# EAGLE design ArachnoProto (EAGLE 6.5.0)
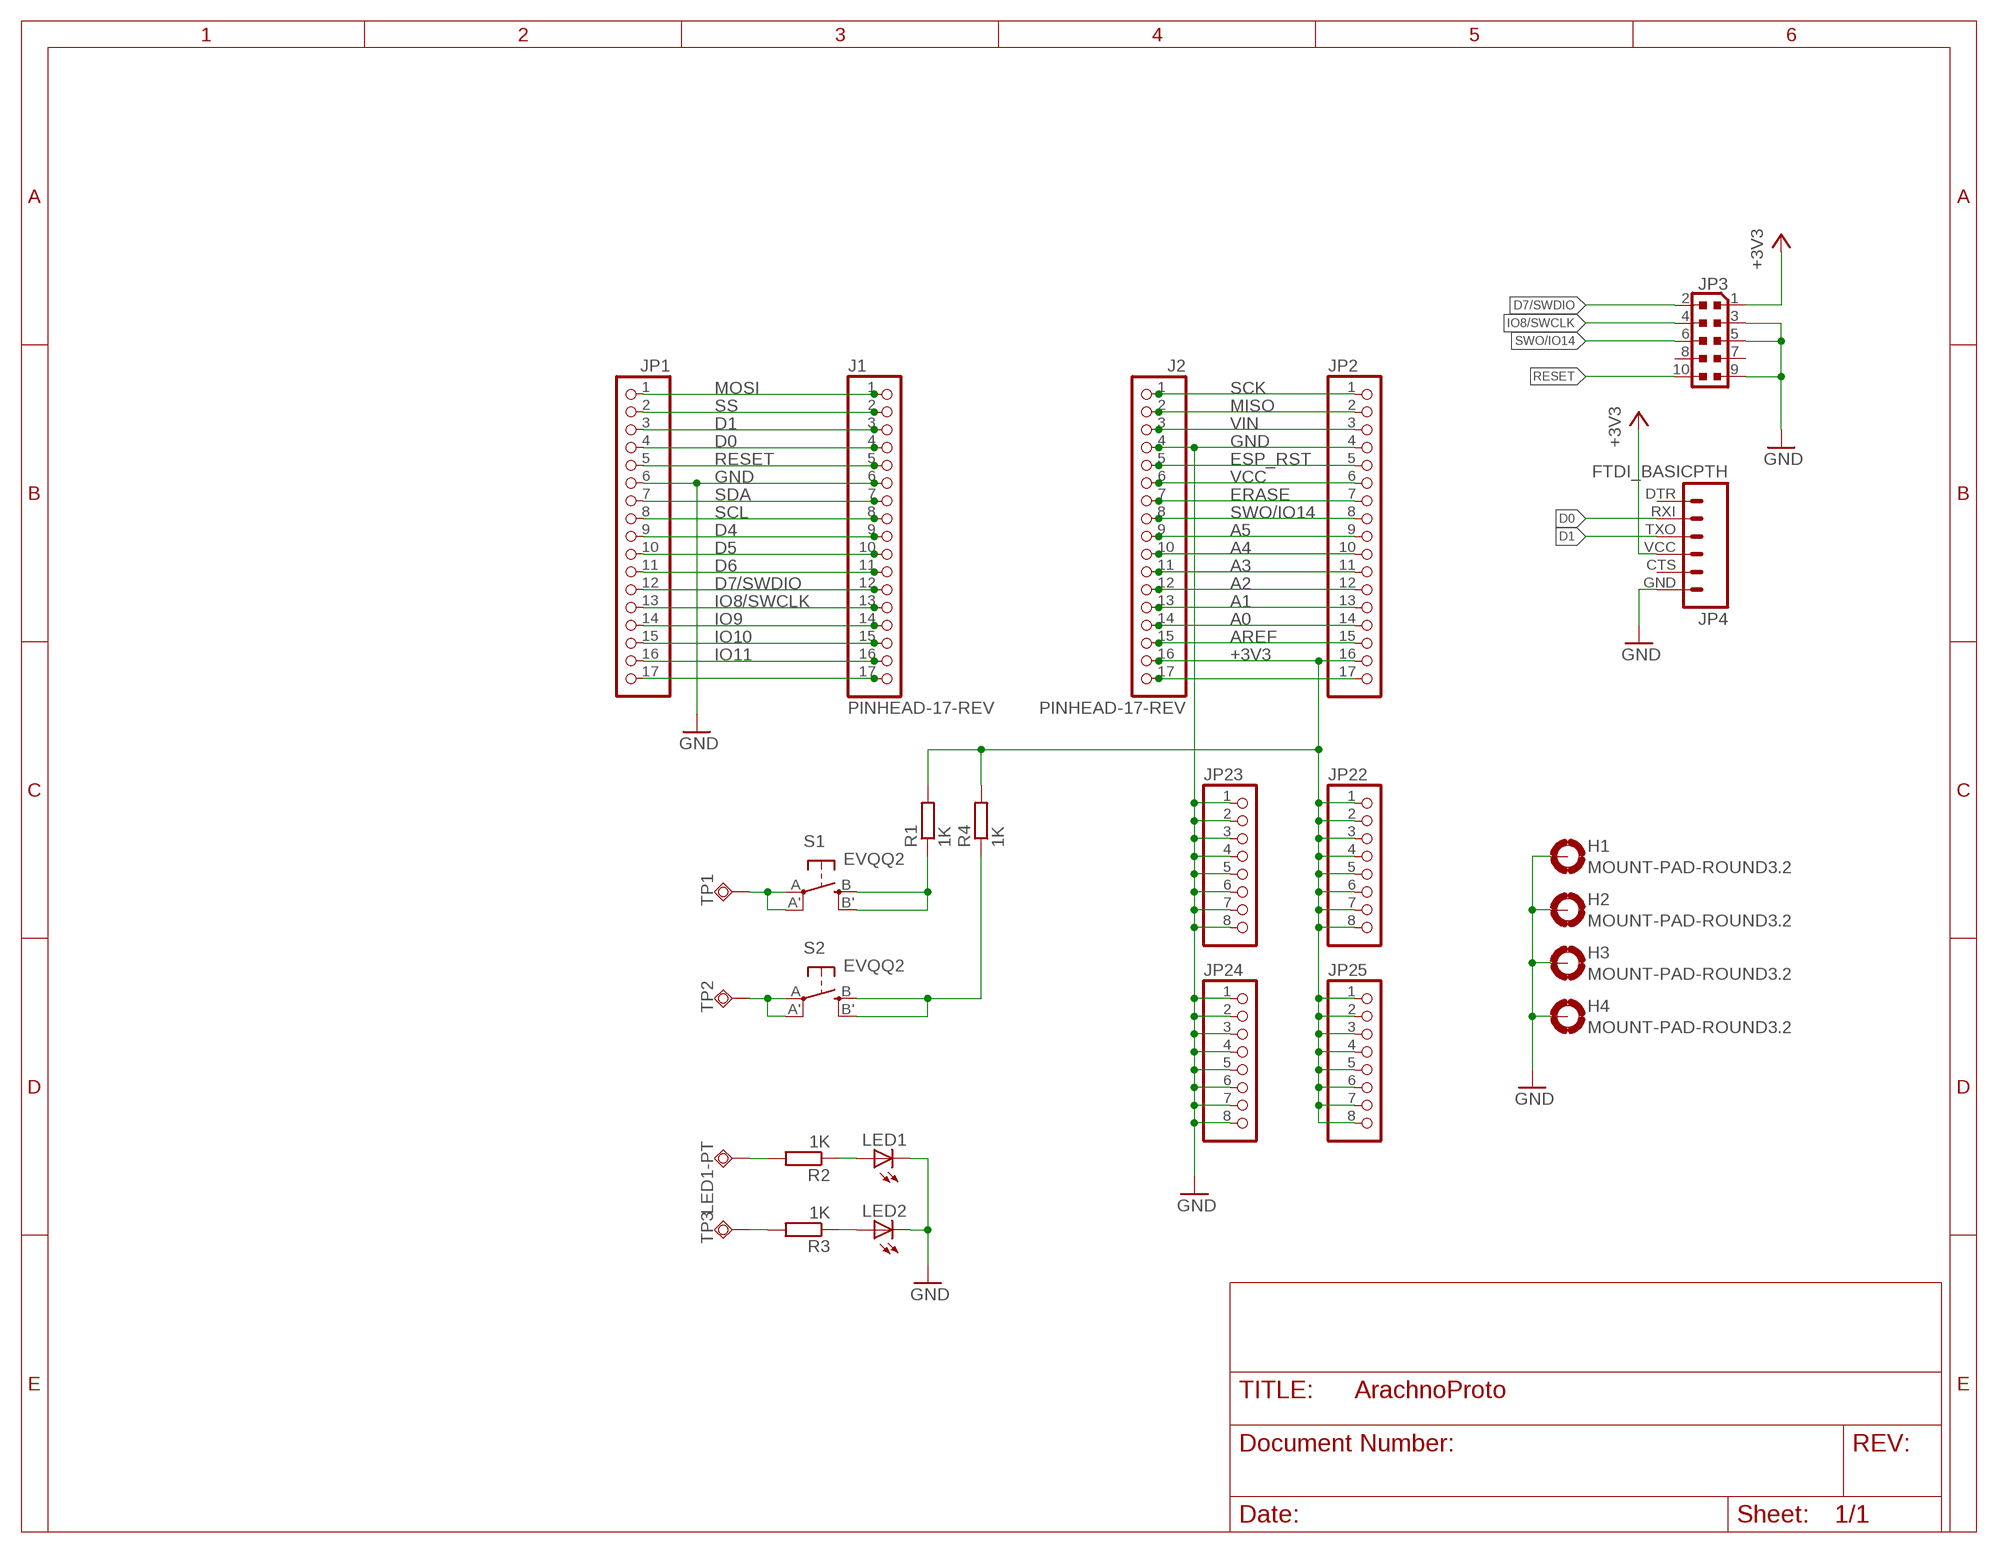
[diagram p0: schematic, sheet 1]

## Parts
H1  MOUNT-PAD-ROUND3.2  [3,2-PAD]
H2  MOUNT-PAD-ROUND3.2  [3,2-PAD]
H3  MOUNT-PAD-ROUND3.2  [3,2-PAD]
H4  MOUNT-PAD-ROUND3.2  [3,2-PAD]
J1  PINHEAD-17-REV  [4UCONN-12573]
J2  PINHEAD-17-REV  [4UCONN-12573]
JP1  PINHD-1X17  [1X17]
JP2  PINHD-1X17  [1X17]
JP3  PINHEAD_PINHD-2X5PASSO127  [PINHEAD_2X05_127]
JP4  FTDI_BASICPTH  [FTDI_BASIC]
JP22  PINHD-1X8  [1X08]
JP23  PINHD-1X8  [1X08]
JP24  PINHD-1X8  [1X08]
JP25  PINHD-1X8  [1X08]
LED1  LEDCHIPLED_1206  [CHIPLED_1206]
LED1-PT  TPSQPAD1-20Y  [P1-20Y]
LED2  LEDCHIPLED_1206  [CHIPLED_1206]
R1  1K  R-EU_R1206  [R1206]
R2  1K  R-EU_R1206  [R1206]
R3  1K  R-EU_R1206  [R1206]
R4  1K  R-EU_R1206  [R1206]
S1  EVQQ2  [EVQ-Q2]
S2  EVQQ2  [EVQ-Q2]
TP1  TPSQPAD1-20Y  [P1-20Y]
TP2  TPSQPAD1-20Y  [P1-20Y]
TP3  TPSQPAD1-20Y  [P1-20Y]

## Nets
+3V3: J2.16 J2.33 J2.50 JP2.16 JP3.1 JP4.VCC JP22.1 JP22.2 JP22.3 JP22.4 JP22.5 JP22.6 JP22.7 JP22.8 JP25.1 JP25.2 JP25.3 JP25.4 JP25.5 JP25.6 JP25.7 JP25.8 R1.2 R4.2
A0: J2.14 J2.31 J2.48 JP2.14
A1: J2.13 J2.30 J2.47 JP2.13
A2: J2.12 J2.29 J2.46 JP2.12
A3: J2.11 J2.28 J2.45 JP2.11
A4: J2.10 J2.27 J2.44 JP2.10
A5: J2.9 J2.26 J2.43 JP2.9
AREF: J2.15 J2.32 J2.49 JP2.15
D0: J1.4 J1.21 J1.38 JP1.4 JP4.RXI
D1: J1.3 J1.20 J1.37 JP1.3 JP4.TXO
D4: J1.9 J1.26 J1.43 JP1.9
D5: J1.10 J1.27 J1.44 JP1.10
D6: J1.11 J1.28 J1.45 JP1.11
D7/SWDIO: J1.12 J1.29 J1.46 JP1.12 JP3.2
ERASE: J2.7 J2.24 J2.41 JP2.7
ESP_RST: J2.5 J2.22 J2.39 JP2.5
GND: H1.B3,2(MOUNT) H2.B3,2(MOUNT) H3.B3,2(MOUNT) H4.B3,2(MOUNT) J1.6 J1.23 J1.40 J2.4 J2.21 J2.38 JP1.6 JP2.4 JP3.3 JP3.5 JP3.9 JP4.GND JP23.1 JP23.2 JP23.3 JP23.4 JP23.5 JP23.6 JP23.7 JP23.8 JP24.1 JP24.2 JP24.3 JP24.4 JP24.5 JP24.6 JP24.7 JP24.8 LED1.C LED2.C
IO8/SWCLK: J1.13 J1.30 J1.47 JP1.13 JP3.4
IO9: J1.14 J1.31 J1.48 JP1.14
IO10: J1.15 J1.32 J1.49 JP1.15
IO11: J1.16 J1.33 J1.50 JP1.16
IO12: J1.17 J1.34 J1.51 JP1.17
IO13: J2.17 J2.34 J2.51 JP2.17
MISO: J2.2 J2.19 J2.36 JP2.2
MOSI: J1.1 J1.18 J1.35 JP1.1
N$1: LED1.A R2.1
N$3: LED2.A R3.1
N$5: LED1-PT.TP R2.2
N$6: R3.2 TP3.TP
N$7: S1.A'(P1) S1.A(P) TP1.TP
N$8: R1.1 S1.B'(S1) S1.B(S)
N$69: R4.1 S2.B'(S1) S2.B(S)
N$70: S2.A'(P1) S2.A(P) TP2.TP
RESET: J1.5 J1.22 J1.39 JP1.5 JP3.10
SCK: J2.1 J2.18 J2.35 JP2.1
SCL: J1.8 J1.25 J1.42 JP1.8
SDA: J1.7 J1.24 J1.41 JP1.7
SS: J1.2 J1.19 J1.36 JP1.2
SWO/IO14: J2.8 J2.25 J2.42 JP2.8 JP3.6
VCC: J2.6 J2.23 J2.40 JP2.6
VIN: J2.3 J2.20 J2.37 JP2.3
Unconnected: JP3.7 JP3.8 JP4.CTS JP4.DTR

## Library data of the parts
H1-H4 = holes:MOUNT-PAD-ROUND: MOUNTING PAD, round
J1 J2 = logos-headers:PINHEAD-17-REV
JP1 JP2 = pinhead:PINHD-1X17: PIN HEADER
JP3 = atmel-d21:PINHEAD_PINHD-2X5: PIN HEADER
JP4 = SparkFun-Connectors:FTDI_BASIC: FTDI Basic header with labels
JP22-JP25 = pinhead:PINHD-1X8: PIN HEADER
LED1 LED2 = led:LED: LED OSRAM: - CHIPLED LG R971, LG N971, LY N971, LG Q971, LY Q971, LO R971, LY R971 LH N974, LH R974 LS Q976, LO Q976, LY Q976 LO Q996 - Hyper CHIPLED LW Q18S LB Q993, LB Q99A, LB R99A - SideLED LS A670, LO A670, LY A670, LG A670, LP A670 LB A673, LV A673, LT A673, LW A673 LH A674 LY A675 LS A676, LA A676, LO A676, LY A676, LW A676 LS A679, LY A679, LG A679 - Hyper Micro SIDELED® LS Y876, LA Y876, LO Y876, LY Y876 LT Y87S - SmartLED LW L88C, LW L88S LB L89C, LB L89S, LG L890 LS L89K, LO L89K, LY L89K LS L896, LA L896, LO L896, LY L896 - TOPLED LS T670, LO T670, LY T670, LG T670, LP T670 LSG T670, LSP T670, LSY T670, LOP T670, LYG T670 LG T671, LOG T671, LSG T671 LB T673, LV T673, LT T673, LW T673 LH T674 LS T676, LA T676, LO T676, LY T676, LB T676, LH T676, LSB T676, LW T676 LB T67C, LV T67C, LT T67C, LS T67K, LO T67K, LY T67K, LW E67C LS E67B, LA E67B, LO E67B, LY E67B, LB E67C, LV E67C, LT E67C LW T67C LS T679, LY T679, LG T679 LS T770, LO T770, LY T770, LG T770, LP T770 LB T773, LV T773, LT T773, LW T773 LH T774 LS E675, LA E675, LY E675, LS T675 LS T776, LA T776, LO T776, LY T776, LB T776 LHGB T686 LT T68C, LB T68C - Hyper Mini TOPLED® LB M676 - Mini TOPLED Santana® LG M470 LS M47K, LO M47K, LY M47K Source: http://www.osram.convergy.de LUXEON: - LUMILED® LXK2-PW12-R00, LXK2-PW12-S00, LXK2-PW14-U00, LXK2-PW14-V00 LXK2-PM12-R00, LXK2-PM12-S00, LXK2-PM14-U00 LXK2-PE12-Q00, LXK2-PE12-R00, LXK2-PE12-S00, LXK2-PE14-T00, LXK2-PE14-U00 LXK2-PB12-K00, LXK2-PB12-L00, LXK2-PB12-M00, LXK2-PB14-N00, LXK2-PB14-P00, LXK2-PB14-Q00 LXK2-PR12-L00, LXK2-PR12-M00, LXK2-PR14-Q00, LXK2-PR14-R00 LXK2-PD12-Q00, LXK2-PD12-R00, LXK2-PD12-S00 LXK2-PH12-R00, LXK2-PH12-S00 LXK2-PL12-P00, LXK2-PL12-Q00, LXK2-PL12-R00 Source: www.luxeon.com KINGBRIGHT: KA-3528ASYC Source: www.kingbright.com
LED1-PT TP1-TP3 = test-fixtures:TPSQ: Test pad
R1-R4 = resistor:R-EU_: RESISTOR, European symbol
S1 S2 = adafruit:EVQQ2: SMT 6mm switch, EVQQ2 series http://www.ladyada.net/library/eagle

## Board
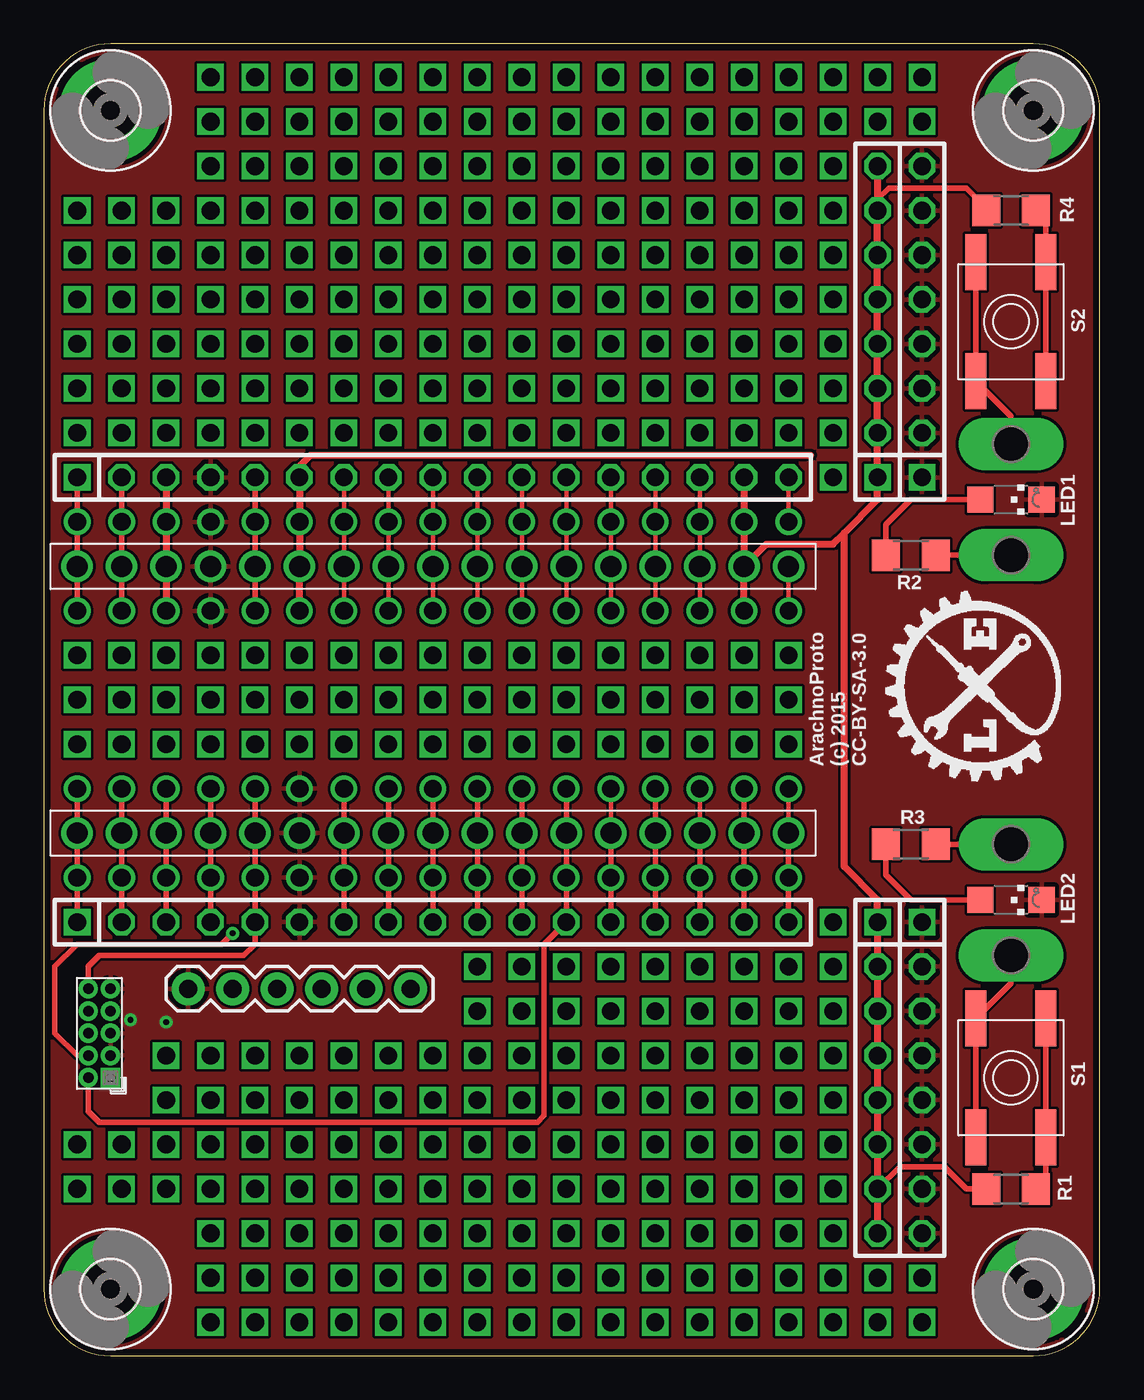
[diagram p1: board, top side]
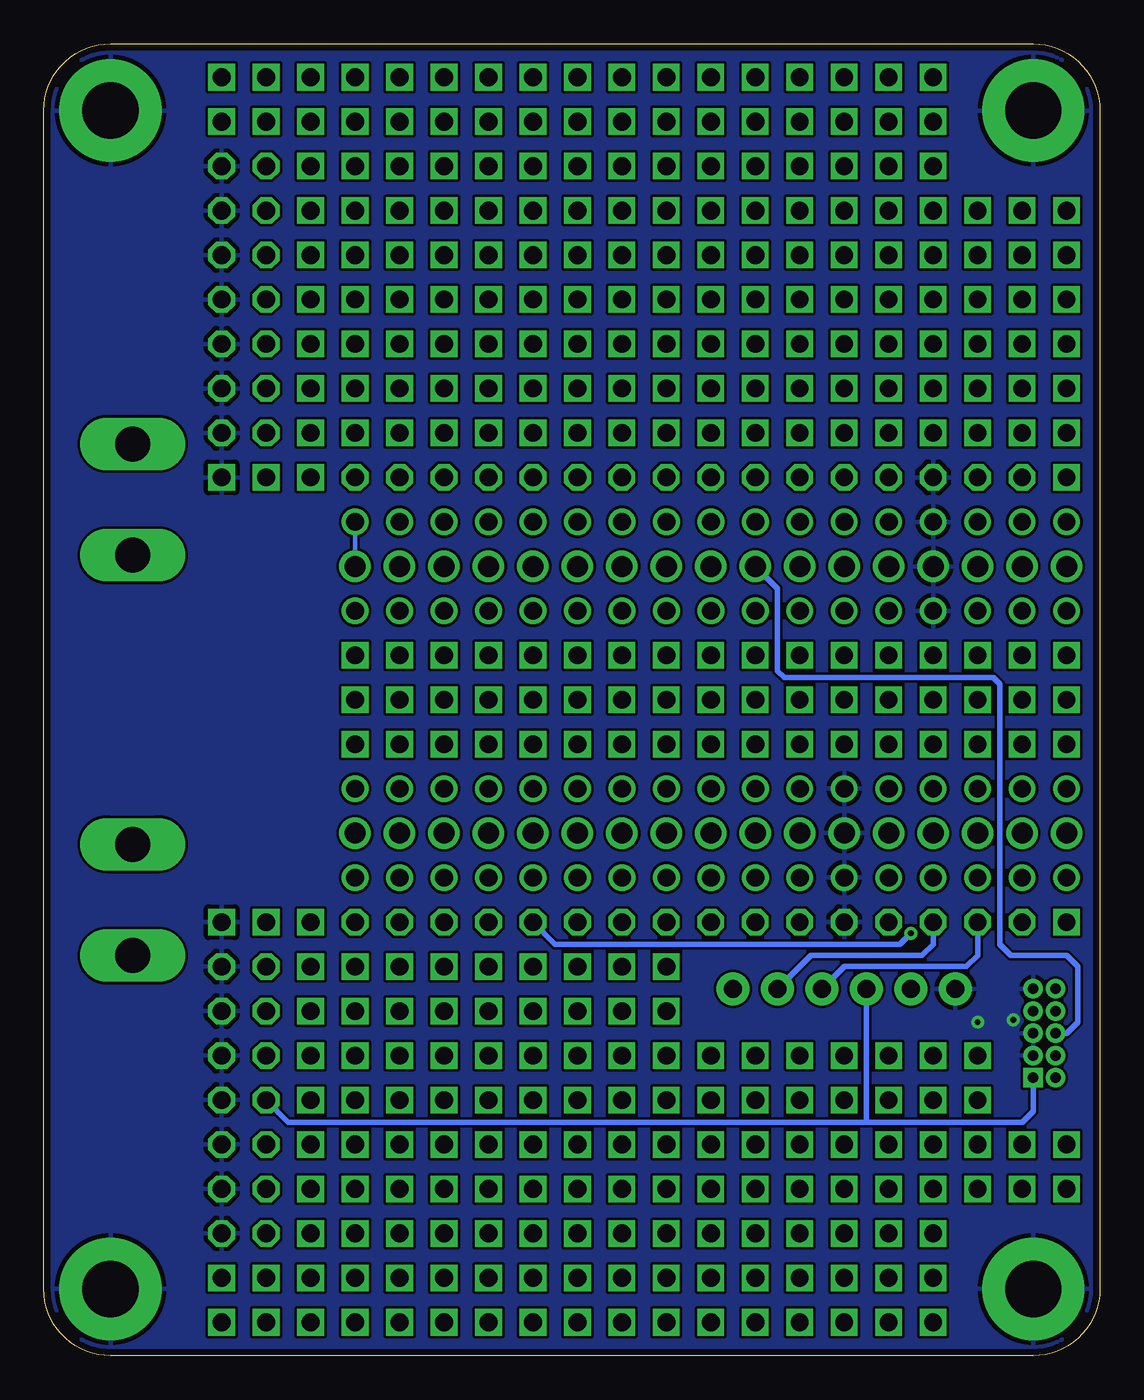
[diagram p2: board, bottom side, seen from below]

Size 60.33 x 74.93 mm. Coordinates in mm from the lower left corner, seen from the top.
Outline: 0,71.12 0,3.81 arc90 3.81,0 56.52,0 arc90 60.33,3.81 60.33,71.12 arc90 56.52,74.93 3.81,74.93 arc90 0,71.12
Copper layers (1*16): Top 0.035mm / dielectric 1.5mm / Bottom 0.035mm
Design rules "default *": minimum track width 6mil, minimum drill 13mil, track to track 6mil, track to pad 6mil, pad to pad 6mil, via to via 6mil, smd to smd 6mil, copper to edge 15mil, drill to drill 15mil, minimum pad ring 10mil, minimum via ring 8mil, stop-mask expansion 4mil, vias tented up to drill 0mil, thermal gap 10mil

### Footprints (pad centres in the part's own frame; a part is rotated, then mirrored left to right if it is on the bottom)
3,2-PAD = drill 3.2 pad 5.842: B3,2 0,0
4UCONN-12573 = drill 1.2: 1 -20.32,0; 2 -17.78,0; 3 -15.24,0; 4 -12.7,0; 5 -10.16,0; 6 -7.62,0; 7 -5.08,0; 8 -2.54,0; 9 0,0; 10 2.54,0; 11 5.08,0; 12 7.62,0; 13 10.16,0; 14 12.7,0; 15 15.24,0; 16 17.78,0; 17 20.32,0 | drill 1.02: 18 -20.32,-2.54; 19 -17.78,2.54; 20 -15.24,-2.54; 21 -12.7,2.54; 22 -10.16,-2.54; 23 -7.62,2.54; 24 -5.08,-2.54; 25 -2.54,2.54; 26 0,-2.54; 27 2.54,2.54; 28 5.08,-2.54; 29 7.62,2.54; 30 10.16,-2.54; 31 12.7,2.54; 32 15.24,-2.54; 33 17.78,2.54; 34 20.32,-2.54; 35 -20.32,2.54; 36 -17.78,-2.54; 37 -15.24,2.54; 38 -12.7,-2.54; 39 -10.16,2.54; 40 -7.62,-2.54; 41 -5.08,2.54; 42 -2.54,-2.54; 43 0,2.54; 44 2.54,-2.54; 45 5.08,2.54; 46 7.62,-2.54; 47 10.16,2.54; 48 12.7,-2.54; 49 15.24,2.54; 50 17.78,-2.54; 51 20.32,2.54
1X17 = drill 1.016 square: 1 -20.32,0 | drill 1.016 octagon: 2 -17.78,0; 3 -15.24,0; 4 -12.7,0; 5 -10.16,0; 6 -7.62,0; 7 -5.08,0; 8 -2.54,0; 9 0,0; 10 2.54,0; 11 5.08,0; 12 7.62,0; 13 10.16,0; 14 12.7,0; 15 15.24,0; 16 17.78,0; 17 20.32,0
PINHEAD_2X05_127 = drill 0.6 pad 1.016 square: 1 -0.635,2.54 | drill 0.6 pad 1.016: 2 0.635,2.54; 3 -0.635,1.27; 4 0.635,1.27; 5 -0.635,0; 6 0.635,0; 7 -0.635,-1.27; 8 0.635,-1.27; 9 -0.635,-2.54; 10 0.635,-2.54
FTDI_BASIC = drill 1.016 pad 1.88: CTS 10.16,0; DTR 0,0; GND 12.7,0; RXI 2.54,0; TXO 5.08,0; VCC 7.62,0
1X08 = drill 1.016 square: 1 -8.89,0 | drill 1.016 octagon: 2 -6.35,0; 3 -3.81,0; 4 -1.27,0; 5 1.27,0; 6 3.81,0; 7 6.35,0; 8 8.89,0
CHIPLED_1206 = smd 1.5 x 1.5: A 0,-1.75; C 0,1.75
P1-20Y = drill 2.007 pad 2.54 long: TP 0,0
R1206 = smd 1.6 x 1.803: 1 -1.422,0; 2 1.422,0
EVQ-Q2 = smd 3.2 x 1.2: A -3.4,-2; A' 3.4,-2; B -3.4,2; B' 3.4,2

### Placement (x,y rotation side)
H1  56.52,3.81 0 top
H2  3.81,3.81 0 top
H3  56.52,71.12 0 top
H4  3.81,71.12 0 top
J1  22.23,29.84 0 top
J2  22.23,45.09 0 top
JP1  22.23,24.77 0 top
JP2  22.23,50.16 0 top
JP3  3.17,18.41 180 top
JP4  20.95,20.95 180 top
JP22  47.62,59.05 90 top
JP23  50.16,15.88 270 top
JP24  50.16,59.05 90 top
JP25  47.62,15.88 270 top
LED1  55.24,48.9 270 top
LED1-PT  55.24,45.72 90 top
LED2  55.24,26.04 270 top
R1  55.24,9.53 180 top
R2  49.53,45.72 0 top
R3  49.53,29.21 0 top
R4  55.24,65.41 180 top
S1  55.24,15.88 270 top
S2  55.24,59.05 270 top
TP1  55.24,22.86 90 top
TP2  55.24,52.07 270 top
TP3  55.24,29.21 90 top
U$1  [LOGO-SM]  58.42,32.38 90 top

### Tracks (layer width: path | path; a pad name or v marks a point on that pad's centre or on a via)
+3V3
  Top 0.305: JP25.7 48.9,10.79 51.44,10.79 52.7,9.53 R1.2 | R4.2 53.82,65.56 52.7,66.67 48.26,66.67 47.62,66.04
  Top 0.406: JP2.16 J2.33 J2.16 | JP22.8 47.62,66.04 JP22.7 JP22.6 JP22.5 JP22.4 JP22.3 JP22.2 JP22.1 47.62,48.9 45.72,46.99 | 45.72,46.99 45.72,27.94 47.62,26.04 JP25.1 JP25.2 JP25.3 JP25.4 JP25.5 JP25.6 JP25.7 JP25.8 | J2.50 J2.16 | J2.16 41.27,46.35 45.09,46.35 45.72,46.99
  Bottom 0.305: 13.34,13.34 4.45,13.34 3.81,13.97 JP3.1 | 13.34,13.34 46.35,13.34 JP25.5 | JP4.VCC 13.34,13.34
A0
  Top 0.254: JP2.14 J2.31 J2.14 J2.48
A1
  Top 0.254: J2.30 J2.13 J2.47 JP2.13
A2
  Top 0.254: JP2.12 J2.29 J2.12 J2.46
A3
  Top 0.254: J2.28 J2.11 J2.45 JP2.11
A4
  Top 0.254: JP2.10 J2.27 J2.10 J2.44
A5
  Top 0.254: J2.26 J2.9 J2.43 JP2.9
AREF
  Top 0.254: J2.32 J2.15 J2.49 JP2.15
D0
  Top 0.305: JP1.4 J1.38 J1.4 J1.21
  Bottom 0.305: JP4.RXI 16.51,22.86 10.16,22.86 9.53,23.5 JP1.4
D1
  Top 0.305: JP1.3 J1.20 J1.3 6.35,29.84 6.99,30.48 J1.37
  Bottom 0.305: JP4.TXO 14.61,22.23 7.62,22.23 6.99,22.86 JP1.3
D4
  Top 0.305: JP1.9 J1.26 J1.9 J1.43
D5
  Top 0.305: JP1.10 J1.44 J1.10 J1.27
D6
  Top 0.305: JP1.11 J1.28 J1.11 J1.45
D7/SWDIO
  Top 0.305: J1.29 J1.12 J1.46 JP1.12 28.57,23.5 28.57,16.38 | 28.57,16.26 28.57,16.38 | JP3.2 2.54,13.97 3.17,13.34 28.19,13.34 28.57,13.72 28.57,16.38
ERASE
  Top 0.254: J2.24 J2.7 J2.41 17.14,49.53 JP2.7
ESP_RST
  Top 0.305: JP2.5 J2.39 J2.5 J2.22
GND  (via drill 0.33)
  other vias: 4.95,19.18 6.99,19.05
  pour Top: 0,0 60.33,0 60.33,74.93 0,74.93
  pour Bottom: 0,74.93 60.33,74.93 60.33,0 0,0
IO8/SWCLK  (via drill 0.33)
  Top 0.254: J1.47 J1.13
  Top 0.305: J1.13 J1.30 JP1.13 | v10.79,24.13 10.16,23.5 1.91,23.5 0.64,22.23 0.64,18.41 1.91,17.14 JP3.4
  Bottom 0.305: v10.79,24.13 11.43,23.5 31.11,23.5 JP1.13
IO9
  Top 0.305: JP1.14 J1.48 J1.14 J1.31
IO10
  Top 0.254: J1.49 J1.15
  Top 0.305: J1.15 J1.32 JP1.15
IO11
  Top 0.305: JP1.16 J1.50 J1.16 J1.33
IO12
  Top 0.254: J1.51 J1.17
  Top 0.305: J1.17 J1.34 JP1.17
IO13
  Top 0.254: J2.34 J2.17 | J2.51 JP2.17
  Bottom 0.254: J2.17 J2.51
MISO
  Top 0.305: JP2.2 J2.19 J2.2 J2.36
MOSI
  Top 0.305: JP1.1 J1.18 J1.1 J1.35
N$1
  Top 0.305: R2.1 48.11,47.47 49.53,48.9 LED1.A
N$2  (via drill 1.02)
  other vias: 45.09,50.16
N$3
  Top 0.305: R3.1 48.11,27.46 49.53,26.04 LED2.A
N$4  (via drill 1.02)
  other vias: 45.09,52.7
N$5
  Top 0.305: LED1-PT.TP R2.2
N$6
  Top 0.305: R3.2 TP3.TP
N$7
  Top 0.305: TP1.TP 55.24,21.27 S1.A S1.A'
N$8
  Top 0.305: S1.B S1.B' 57.24,10.1 R1.1
N$9  (via drill 1.02)
  other vias: 45.09,55.24
N$10  (via drill 1.02)
  other vias: 45.09,57.78
N$11  (via drill 1.02)
  other vias: 45.09,60.33
N$12  (via drill 1.02)
  other vias: 45.09,62.87
N$13  (via drill 1.02)
  other vias: 45.09,65.41
N$14  (via drill 1.02)
  other vias: 45.09,67.94
N$15  (via drill 1.02)
  other vias: 45.09,6.99
N$16  (via drill 1.02)
  other vias: 24.77,22.23
N$17  (via drill 1.02)
  other vias: 27.3,22.23
N$18  (via drill 1.02)
  other vias: 29.84,22.23
N$19  (via drill 1.02)
  other vias: 32.38,22.23
N$20  (via drill 1.02)
  other vias: 34.92,22.23
N$21  (via drill 1.02)
  other vias: 37.47,22.23
N$22  (via drill 1.02)
  other vias: 40.01,22.23
N$23  (via drill 1.02)
  other vias: 42.55,22.23
N$24  (via drill 1.02)
  other vias: 45.09,9.53
N$25  (via drill 1.02)
  other vias: 45.09,12.06
N$26  (via drill 1.02)
  other vias: 45.09,14.61
N$27  (via drill 1.02)
  other vias: 45.09,17.14
N$28  (via drill 1.02)
  other vias: 45.09,19.68
N$29  (via drill 1.02)
  other vias: 45.09,22.23
N$30  (via drill 1.02)
  other vias: 45.09,24.77
N$31  (via drill 1.02)
  other vias: 24.77,19.68
N$32  (via drill 1.02)
  other vias: 27.3,19.68
N$33  (via drill 1.02)
  other vias: 29.84,19.68
N$34  (via drill 1.02)
  other vias: 32.38,19.68
N$35  (via drill 1.02)
  other vias: 34.92,19.68
N$36  (via drill 1.02)
  other vias: 37.47,19.68
N$37  (via drill 1.02)
  other vias: 40.01,19.68
N$38  (via drill 1.02)
  other vias: 42.55,19.68
N$39  (via drill 1.02)
  other vias: 6.99,17.14
N$40  (via drill 1.02)
  other vias: 9.53,17.14
N$41  (via drill 1.02)
  other vias: 12.06,17.14
N$42  (via drill 1.02)
  other vias: 14.61,17.14
N$43  (via drill 1.02)
  other vias: 17.14,17.14
N$44  (via drill 1.02)
  other vias: 19.68,17.14
N$45  (via drill 1.02)
  other vias: 22.23,17.14
N$46  (via drill 1.02)
  other vias: 24.77,17.14
N$47  (via drill 1.02)
  other vias: 27.3,17.14
N$48  (via drill 1.02)
  other vias: 29.84,17.14
N$49  (via drill 1.02)
  other vias: 32.38,17.14
N$50  (via drill 1.02)
  other vias: 34.92,17.14
N$51  (via drill 1.02)
  other vias: 37.47,17.14
N$52  (via drill 1.02)
  other vias: 40.01,17.14
N$53  (via drill 1.02)
  other vias: 42.55,17.14
N$54  (via drill 1.02)
  other vias: 6.99,14.61
N$55  (via drill 1.02)
  other vias: 9.53,14.61
N$56  (via drill 1.02)
  other vias: 12.06,14.61
N$57  (via drill 1.02)
  other vias: 14.61,14.61
N$58  (via drill 1.02)
  other vias: 17.14,14.61
N$59  (via drill 1.02)
  other vias: 19.68,14.61
N$60  (via drill 1.02)
  other vias: 22.23,14.61
N$61  (via drill 1.02)
  other vias: 24.77,14.61
N$62  (via drill 1.02)
  other vias: 27.3,14.61
N$63  (via drill 1.02)
  other vias: 29.84,14.61
N$64  (via drill 1.02)
  other vias: 32.38,14.61
N$65  (via drill 1.02)
  other vias: 34.92,14.61
N$66  (via drill 1.02)
  other vias: 37.47,14.61
N$67  (via drill 1.02)
  other vias: 40.01,14.61
N$68  (via drill 1.02)
  other vias: 42.55,14.61
N$69
  Top 0.305: S2.B' S2.B 57.24,64.83 R4.1
N$70
  Top 0.305: TP2.TP 55.24,53.66 S2.A' 53.24,61.5 53.34,61.59 53.34,62.36 S2.A
N$71  (via drill 1.02)
  other vias: 6.99,12.06
N$72  (via drill 1.02)
  other vias: 9.53,12.06
N$73  (via drill 1.02)
  other vias: 12.06,12.06
N$74  (via drill 1.02)
  other vias: 14.61,12.06
N$75  (via drill 1.02)
  other vias: 17.14,12.06
N$76  (via drill 1.02)
  other vias: 19.68,12.06
N$77  (via drill 1.02)
  other vias: 22.23,12.06
N$78  (via drill 1.02)
  other vias: 24.77,12.06
N$79  (via drill 1.02)
  other vias: 27.3,12.06
N$80  (via drill 1.02)
  other vias: 29.84,12.06
N$81  (via drill 1.02)
  other vias: 32.38,12.06
N$82  (via drill 1.02)
  other vias: 34.92,12.06
N$83  (via drill 1.02)
  other vias: 37.47,12.06
N$84  (via drill 1.02)
  other vias: 40.01,12.06
N$85  (via drill 1.02)
  other vias: 42.55,12.06
N$86  (via drill 1.02)
  other vias: 1.91,12.06
N$87  (via drill 1.02)
  other vias: 4.45,12.06
N$88  (via drill 1.02)
  other vias: 6.99,9.53
N$89  (via drill 1.02)
  other vias: 9.53,9.53
N$90  (via drill 1.02)
  other vias: 12.06,9.53
N$91  (via drill 1.02)
  other vias: 14.61,9.53
N$92  (via drill 1.02)
  other vias: 17.14,9.53
N$93  (via drill 1.02)
  other vias: 19.68,9.53
N$94  (via drill 1.02)
  other vias: 22.23,9.53
N$95  (via drill 1.02)
  other vias: 24.77,9.53
N$96  (via drill 1.02)
  other vias: 27.3,9.53
N$97  (via drill 1.02)
  other vias: 29.84,9.53
N$98  (via drill 1.02)
  other vias: 32.38,9.53
N$99  (via drill 1.02)
  other vias: 34.92,9.53
N$100  (via drill 1.02)
  other vias: 37.47,9.53
N$101  (via drill 1.02)
  other vias: 40.01,9.53
N$102  (via drill 1.02)
  other vias: 42.55,9.53
N$103  (via drill 1.02)
  other vias: 1.91,9.53
N$104  (via drill 1.02)
  other vias: 4.45,9.53
N$105  (via drill 1.02)
  other vias: 9.53,73.03
N$106  (via drill 1.02)
  other vias: 9.53,6.99
N$107  (via drill 1.02)
  other vias: 12.06,6.99
N$108  (via drill 1.02)
  other vias: 14.61,6.99
N$109  (via drill 1.02)
  other vias: 17.14,6.99
N$110  (via drill 1.02)
  other vias: 19.68,6.99
N$111  (via drill 1.02)
  other vias: 22.23,6.99
N$112  (via drill 1.02)
  other vias: 24.77,6.99
N$113  (via drill 1.02)
  other vias: 27.3,6.99
N$114  (via drill 1.02)
  other vias: 29.84,6.99
N$115  (via drill 1.02)
  other vias: 32.38,6.99
N$116  (via drill 1.02)
  other vias: 34.92,6.99
N$117  (via drill 1.02)
  other vias: 37.47,6.99
N$118  (via drill 1.02)
  other vias: 40.01,6.99
N$119  (via drill 1.02)
  other vias: 42.55,6.99
N$120  (via drill 1.02)
  other vias: 12.06,70.48
N$121  (via drill 1.02)
  other vias: 14.61,70.48
N$122  (via drill 1.02)
  other vias: 6.99,34.92
N$123  (via drill 1.02)
  other vias: 9.53,34.92
N$124  (via drill 1.02)
  other vias: 12.06,34.92
N$125  (via drill 1.02)
  other vias: 14.61,34.92
N$126  (via drill 1.02)
  other vias: 17.14,34.92
N$127  (via drill 1.02)
  other vias: 19.68,34.92
N$128  (via drill 1.02)
  other vias: 22.23,34.92
N$129  (via drill 1.02)
  other vias: 24.77,34.92
N$130  (via drill 1.02)
  other vias: 27.3,34.92
N$131  (via drill 1.02)
  other vias: 29.84,34.92
N$132  (via drill 1.02)
  other vias: 32.38,34.92
N$133  (via drill 1.02)
  other vias: 34.92,34.92
N$134  (via drill 1.02)
  other vias: 37.47,34.92
N$135  (via drill 1.02)
  other vias: 40.01,34.92
N$136  (via drill 1.02)
  other vias: 42.55,34.92
N$137  (via drill 1.02)
  other vias: 1.91,34.92
N$138  (via drill 1.02)
  other vias: 4.45,34.92
N$139  (via drill 1.02)
  other vias: 6.99,37.47
N$140  (via drill 1.02)
  other vias: 9.53,37.47
N$141  (via drill 1.02)
  other vias: 12.06,37.47
N$142  (via drill 1.02)
  other vias: 14.61,37.47
N$143  (via drill 1.02)
  other vias: 17.14,37.47
N$144  (via drill 1.02)
  other vias: 19.68,37.47
N$145  (via drill 1.02)
  other vias: 22.23,37.47
N$146  (via drill 1.02)
  other vias: 24.77,37.47
N$147  (via drill 1.02)
  other vias: 27.3,37.47
N$148  (via drill 1.02)
  other vias: 29.84,37.47
N$149  (via drill 1.02)
  other vias: 32.38,37.47
N$150  (via drill 1.02)
  other vias: 34.92,37.47
N$151  (via drill 1.02)
  other vias: 37.47,37.47
N$152  (via drill 1.02)
  other vias: 40.01,37.47
N$153  (via drill 1.02)
  other vias: 42.55,37.47
N$154  (via drill 1.02)
  other vias: 1.91,37.47
N$155  (via drill 1.02)
  other vias: 4.45,37.47
N$156  (via drill 1.02)
  other vias: 6.99,40.01
N$157  (via drill 1.02)
  other vias: 9.53,40.01
N$158  (via drill 1.02)
  other vias: 12.06,40.01
N$159  (via drill 1.02)
  other vias: 14.61,40.01
N$160  (via drill 1.02)
  other vias: 17.14,40.01
N$161  (via drill 1.02)
  other vias: 19.68,40.01
N$162  (via drill 1.02)
  other vias: 22.23,40.01
N$163  (via drill 1.02)
  other vias: 24.77,40.01
N$164  (via drill 1.02)
  other vias: 27.3,40.01
N$165  (via drill 1.02)
  other vias: 29.84,40.01
N$166  (via drill 1.02)
  other vias: 32.38,40.01
N$167  (via drill 1.02)
  other vias: 34.92,40.01
N$168  (via drill 1.02)
  other vias: 37.47,40.01
N$169  (via drill 1.02)
  other vias: 40.01,40.01
N$170  (via drill 1.02)
  other vias: 42.55,40.01
N$171  (via drill 1.02)
  other vias: 1.91,40.01
N$172  (via drill 1.02)
  other vias: 4.45,40.01
N$173  (via drill 1.02)
  other vias: 6.99,52.7
N$174  (via drill 1.02)
  other vias: 9.53,52.7
N$175  (via drill 1.02)
  other vias: 12.06,52.7
N$176  (via drill 1.02)
  other vias: 14.61,52.7
N$177  (via drill 1.02)
  other vias: 17.14,52.7
N$178  (via drill 1.02)
  other vias: 19.68,52.7
N$179  (via drill 1.02)
  other vias: 22.23,52.7
N$180  (via drill 1.02)
  other vias: 24.77,52.7
N$181  (via drill 1.02)
  other vias: 27.3,52.7
N$182  (via drill 1.02)
  other vias: 29.84,52.7
N$183  (via drill 1.02)
  other vias: 32.38,52.7
N$184  (via drill 1.02)
  other vias: 34.92,52.7
N$185  (via drill 1.02)
  other vias: 37.47,52.7
N$186  (via drill 1.02)
  other vias: 40.01,52.7
N$187  (via drill 1.02)
  other vias: 42.55,52.7
N$188  (via drill 1.02)
  other vias: 1.91,52.7
N$189  (via drill 1.02)
  other vias: 4.45,52.7
N$190  (via drill 1.02)
  other vias: 6.99,55.24
N$191  (via drill 1.02)
  other vias: 9.53,55.24
N$192  (via drill 1.02)
  other vias: 12.06,55.24
N$193  (via drill 1.02)
  other vias: 14.61,55.24
N$194  (via drill 1.02)
  other vias: 17.14,55.24
N$195  (via drill 1.02)
  other vias: 19.68,55.24
N$196  (via drill 1.02)
  other vias: 22.23,55.24
N$197  (via drill 1.02)
  other vias: 24.77,55.24
N$198  (via drill 1.02)
  other vias: 27.3,55.24
N$199  (via drill 1.02)
  other vias: 29.84,55.24
N$200  (via drill 1.02)
  other vias: 32.38,55.24
N$201  (via drill 1.02)
  other vias: 34.92,55.24
N$202  (via drill 1.02)
  other vias: 37.47,55.24
N$203  (via drill 1.02)
  other vias: 40.01,55.24
N$204  (via drill 1.02)
  other vias: 42.55,55.24
N$205  (via drill 1.02)
  other vias: 1.91,55.24
N$206  (via drill 1.02)
  other vias: 4.45,55.24
N$207  (via drill 1.02)
  other vias: 6.99,57.78
N$208  (via drill 1.02)
  other vias: 9.53,57.78
N$209  (via drill 1.02)
  other vias: 12.06,57.78
N$210  (via drill 1.02)
  other vias: 14.61,57.78
N$211  (via drill 1.02)
  other vias: 17.14,57.78
N$212  (via drill 1.02)
  other vias: 19.68,57.78
N$213  (via drill 1.02)
  other vias: 22.23,57.78
N$214  (via drill 1.02)
  other vias: 24.77,57.78
N$215  (via drill 1.02)
  other vias: 27.3,57.78
N$216  (via drill 1.02)
  other vias: 29.84,57.78
N$217  (via drill 1.02)
  other vias: 32.38,57.78
N$218  (via drill 1.02)
  other vias: 34.92,57.78
N$219  (via drill 1.02)
  other vias: 37.47,57.78
N$220  (via drill 1.02)
  other vias: 40.01,57.78
N$221  (via drill 1.02)
  other vias: 42.55,57.78
N$222  (via drill 1.02)
  other vias: 1.91,57.78
N$223  (via drill 1.02)
  other vias: 4.45,57.78
N$224  (via drill 1.02)
  other vias: 6.99,60.33
N$225  (via drill 1.02)
  other vias: 9.53,60.33
N$226  (via drill 1.02)
  other vias: 12.06,60.33
N$227  (via drill 1.02)
  other vias: 14.61,60.33
N$228  (via drill 1.02)
  other vias: 17.14,60.33
N$229  (via drill 1.02)
  other vias: 19.68,60.33
N$230  (via drill 1.02)
  other vias: 22.23,60.33
N$231  (via drill 1.02)
  other vias: 24.77,60.33
N$232  (via drill 1.02)
  other vias: 27.3,60.33
N$233  (via drill 1.02)
  other vias: 29.84,60.33
N$234  (via drill 1.02)
  other vias: 32.38,60.33
N$235  (via drill 1.02)
  other vias: 34.92,60.33
N$236  (via drill 1.02)
  other vias: 37.47,60.33
N$237  (via drill 1.02)
  other vias: 40.01,60.33
N$238  (via drill 1.02)
  other vias: 42.55,60.33
N$239  (via drill 1.02)
  other vias: 1.91,60.33
N$240  (via drill 1.02)
  other vias: 4.45,60.33
N$241  (via drill 1.02)
  other vias: 6.99,62.87
N$242  (via drill 1.02)
  other vias: 9.53,62.87
N$243  (via drill 1.02)
  other vias: 12.06,62.87
N$244  (via drill 1.02)
  other vias: 14.61,62.87
N$245  (via drill 1.02)
  other vias: 17.14,62.87
N$246  (via drill 1.02)
  other vias: 19.68,62.87
N$247  (via drill 1.02)
  other vias: 22.23,62.87
N$248  (via drill 1.02)
  other vias: 24.77,62.87
N$249  (via drill 1.02)
  other vias: 27.3,62.87
N$250  (via drill 1.02)
  other vias: 29.84,62.87
N$251  (via drill 1.02)
  other vias: 32.38,62.87
N$252  (via drill 1.02)
  other vias: 34.92,62.87
N$253  (via drill 1.02)
  other vias: 37.47,62.87
N$254  (via drill 1.02)
  other vias: 40.01,62.87
N$255  (via drill 1.02)
  other vias: 42.55,62.87
N$256  (via drill 1.02)
  other vias: 1.91,62.87
N$257  (via drill 1.02)
  other vias: 4.45,62.87
N$258  (via drill 1.02)
  other vias: 6.99,65.41
N$259  (via drill 1.02)
  other vias: 9.53,65.41
N$260  (via drill 1.02)
  other vias: 12.06,65.41
N$261  (via drill 1.02)
  other vias: 14.61,65.41
N$262  (via drill 1.02)
  other vias: 17.14,65.41
N$263  (via drill 1.02)
  other vias: 19.68,65.41
N$264  (via drill 1.02)
  other vias: 22.23,65.41
N$265  (via drill 1.02)
  other vias: 24.77,65.41
N$266  (via drill 1.02)
  other vias: 27.3,65.41
N$267  (via drill 1.02)
  other vias: 29.84,65.41
N$268  (via drill 1.02)
  other vias: 32.38,65.41
N$269  (via drill 1.02)
  other vias: 34.92,65.41
N$270  (via drill 1.02)
  other vias: 37.47,65.41
N$271  (via drill 1.02)
  other vias: 40.01,65.41
N$272  (via drill 1.02)
  other vias: 42.55,65.41
N$273  (via drill 1.02)
  other vias: 1.91,65.41
N$274  (via drill 1.02)
  other vias: 4.45,65.41
N$275  (via drill 1.02)
  other vias: 17.14,70.48
N$276  (via drill 1.02)
  other vias: 9.53,67.94
N$277  (via drill 1.02)
  other vias: 12.06,67.94
N$278  (via drill 1.02)
  other vias: 14.61,67.94
N$279  (via drill 1.02)
  other vias: 17.14,67.94
N$280  (via drill 1.02)
  other vias: 19.68,67.94
N$281  (via drill 1.02)
  other vias: 22.23,67.94
N$282  (via drill 1.02)
  other vias: 24.77,67.94
N$283  (via drill 1.02)
  other vias: 27.3,67.94
N$284  (via drill 1.02)
  other vias: 29.84,67.94
N$285  (via drill 1.02)
  other vias: 32.38,67.94
N$286  (via drill 1.02)
  other vias: 34.92,67.94
N$287  (via drill 1.02)
  other vias: 37.47,67.94
N$288  (via drill 1.02)
  other vias: 40.01,67.94
N$289  (via drill 1.02)
  other vias: 42.55,67.94
N$290  (via drill 1.02)
  other vias: 19.68,70.48
N$291  (via drill 1.02)
  other vias: 22.23,70.48
N$292  (via drill 1.02)
  other vias: 24.77,70.48
N$293  (via drill 1.02)
  other vias: 27.3,70.48
N$294  (via drill 1.02)
  other vias: 29.84,70.48
N$295  (via drill 1.02)
  other vias: 32.38,70.48
N$296  (via drill 1.02)
  other vias: 34.92,70.48
N$297  (via drill 1.02)
  other vias: 37.47,70.48
N$298  (via drill 1.02)
  other vias: 40.01,70.48
N$299  (via drill 1.02)
  other vias: 42.55,70.48
N$300  (via drill 1.02)
  other vias: 12.06,73.03
N$301  (via drill 1.02)
  other vias: 14.61,73.03
N$302  (via drill 1.02)
  other vias: 17.14,73.03
N$303  (via drill 1.02)
  other vias: 19.68,73.03
N$304  (via drill 1.02)
  other vias: 22.23,73.03
N$305  (via drill 1.02)
  other vias: 24.77,73.03
N$306  (via drill 1.02)
  other vias: 27.3,73.03
N$307  (via drill 1.02)
  other vias: 29.84,73.03
N$308  (via drill 1.02)
  other vias: 32.38,73.03
N$309  (via drill 1.02)
  other vias: 34.92,73.03
N$310  (via drill 1.02)
  other vias: 37.47,73.03
N$311  (via drill 1.02)
  other vias: 40.01,73.03
N$312  (via drill 1.02)
  other vias: 42.55,73.03
N$313  (via drill 1.02)
  other vias: 9.53,4.45
N$314  (via drill 1.02)
  other vias: 12.06,4.45
N$315  (via drill 1.02)
  other vias: 14.61,4.45
N$316  (via drill 1.02)
  other vias: 17.14,4.45
N$317  (via drill 1.02)
  other vias: 19.68,4.45
N$318  (via drill 1.02)
  other vias: 22.23,4.45
N$319  (via drill 1.02)
  other vias: 24.77,4.45
N$320  (via drill 1.02)
  other vias: 27.3,4.45
N$321  (via drill 1.02)
  other vias: 29.84,4.45
N$322  (via drill 1.02)
  other vias: 32.38,4.45
N$323  (via drill 1.02)
  other vias: 34.92,4.45
N$324  (via drill 1.02)
  other vias: 37.47,4.45
N$325  (via drill 1.02)
  other vias: 40.01,4.45
N$326  (via drill 1.02)
  other vias: 42.55,4.45
N$327  (via drill 1.02)
  other vias: 9.53,1.91
N$328  (via drill 1.02)
  other vias: 12.06,1.91
N$329  (via drill 1.02)
  other vias: 14.61,1.91
N$330  (via drill 1.02)
  other vias: 17.14,1.91
N$331  (via drill 1.02)
  other vias: 19.68,1.91
N$332  (via drill 1.02)
  other vias: 22.23,1.91
N$333  (via drill 1.02)
  other vias: 24.77,1.91
N$334  (via drill 1.02)
  other vias: 27.3,1.91
N$335  (via drill 1.02)
  other vias: 29.84,1.91
N$336  (via drill 1.02)
  other vias: 32.38,1.91
N$337  (via drill 1.02)
  other vias: 34.92,1.91
N$338  (via drill 1.02)
  other vias: 37.47,1.91
N$339  (via drill 1.02)
  other vias: 40.01,1.91
N$340  (via drill 1.02)
  other vias: 42.55,1.91
N$341  (via drill 1.02)
  other vias: 45.09,4.45
N$342  (via drill 1.02)
  other vias: 47.62,4.45
N$343  (via drill 1.02)
  other vias: 50.16,4.45
N$344  (via drill 1.02)
  other vias: 45.09,1.91
N$345  (via drill 1.02)
  other vias: 47.62,1.91
N$346  (via drill 1.02)
  other vias: 50.16,1.91
N$347  (via drill 1.02)
  other vias: 45.09,73.03
N$348  (via drill 1.02)
  other vias: 47.62,73.03
N$349  (via drill 1.02)
  other vias: 50.16,73.03
N$350  (via drill 1.02)
  other vias: 45.09,70.48
N$351  (via drill 1.02)
  other vias: 47.62,70.48
N$352  (via drill 1.02)
  other vias: 50.16,70.48
N$353  (via drill 1.02)
  other vias: 9.53,70.48
RESET
  Top 0.305: J1.39 J1.5 J1.22 JP1.5 12.06,23.5 11.43,22.86 3.17,22.86 2.54,22.23 JP3.10
SCK
  Top 0.305: JP2.1 J2.35 J2.1 J2.18
SCL
  Top 0.305: JP1.8 J1.42 J1.8 J1.25
SDA
  Top 0.305: JP1.7 J1.24 J1.7 J1.41
SS
  Top 0.305: J1.19 J1.2 J1.36 JP1.2
SWO/IO14
  Top 0.254: JP2.8 J2.25 J2.8 J2.42
  Bottom 0.305: J2.8 18.41,43.81 18.41,39.12 18.03,38.73 6.1,38.73 5.71,38.35 5.71,23.5 5.08,22.86 1.91,22.86 1.27,22.23 1.27,19.05 1.91,18.41 JP3.6
VCC
  Top 0.406: 43.81,51.44 15.24,51.44 14.61,50.8 JP2.6 J2.23 J2.6 J2.40
VIN
  Top 0.406: JP2.3 J2.37 J2.3 J2.20

### Text on the board
tPlace: ArachnoProto / (c) 2015 / CC-BY-SA-3.0